# Altium schematic sheet wifi_car_mcu.SchDoc
size A3
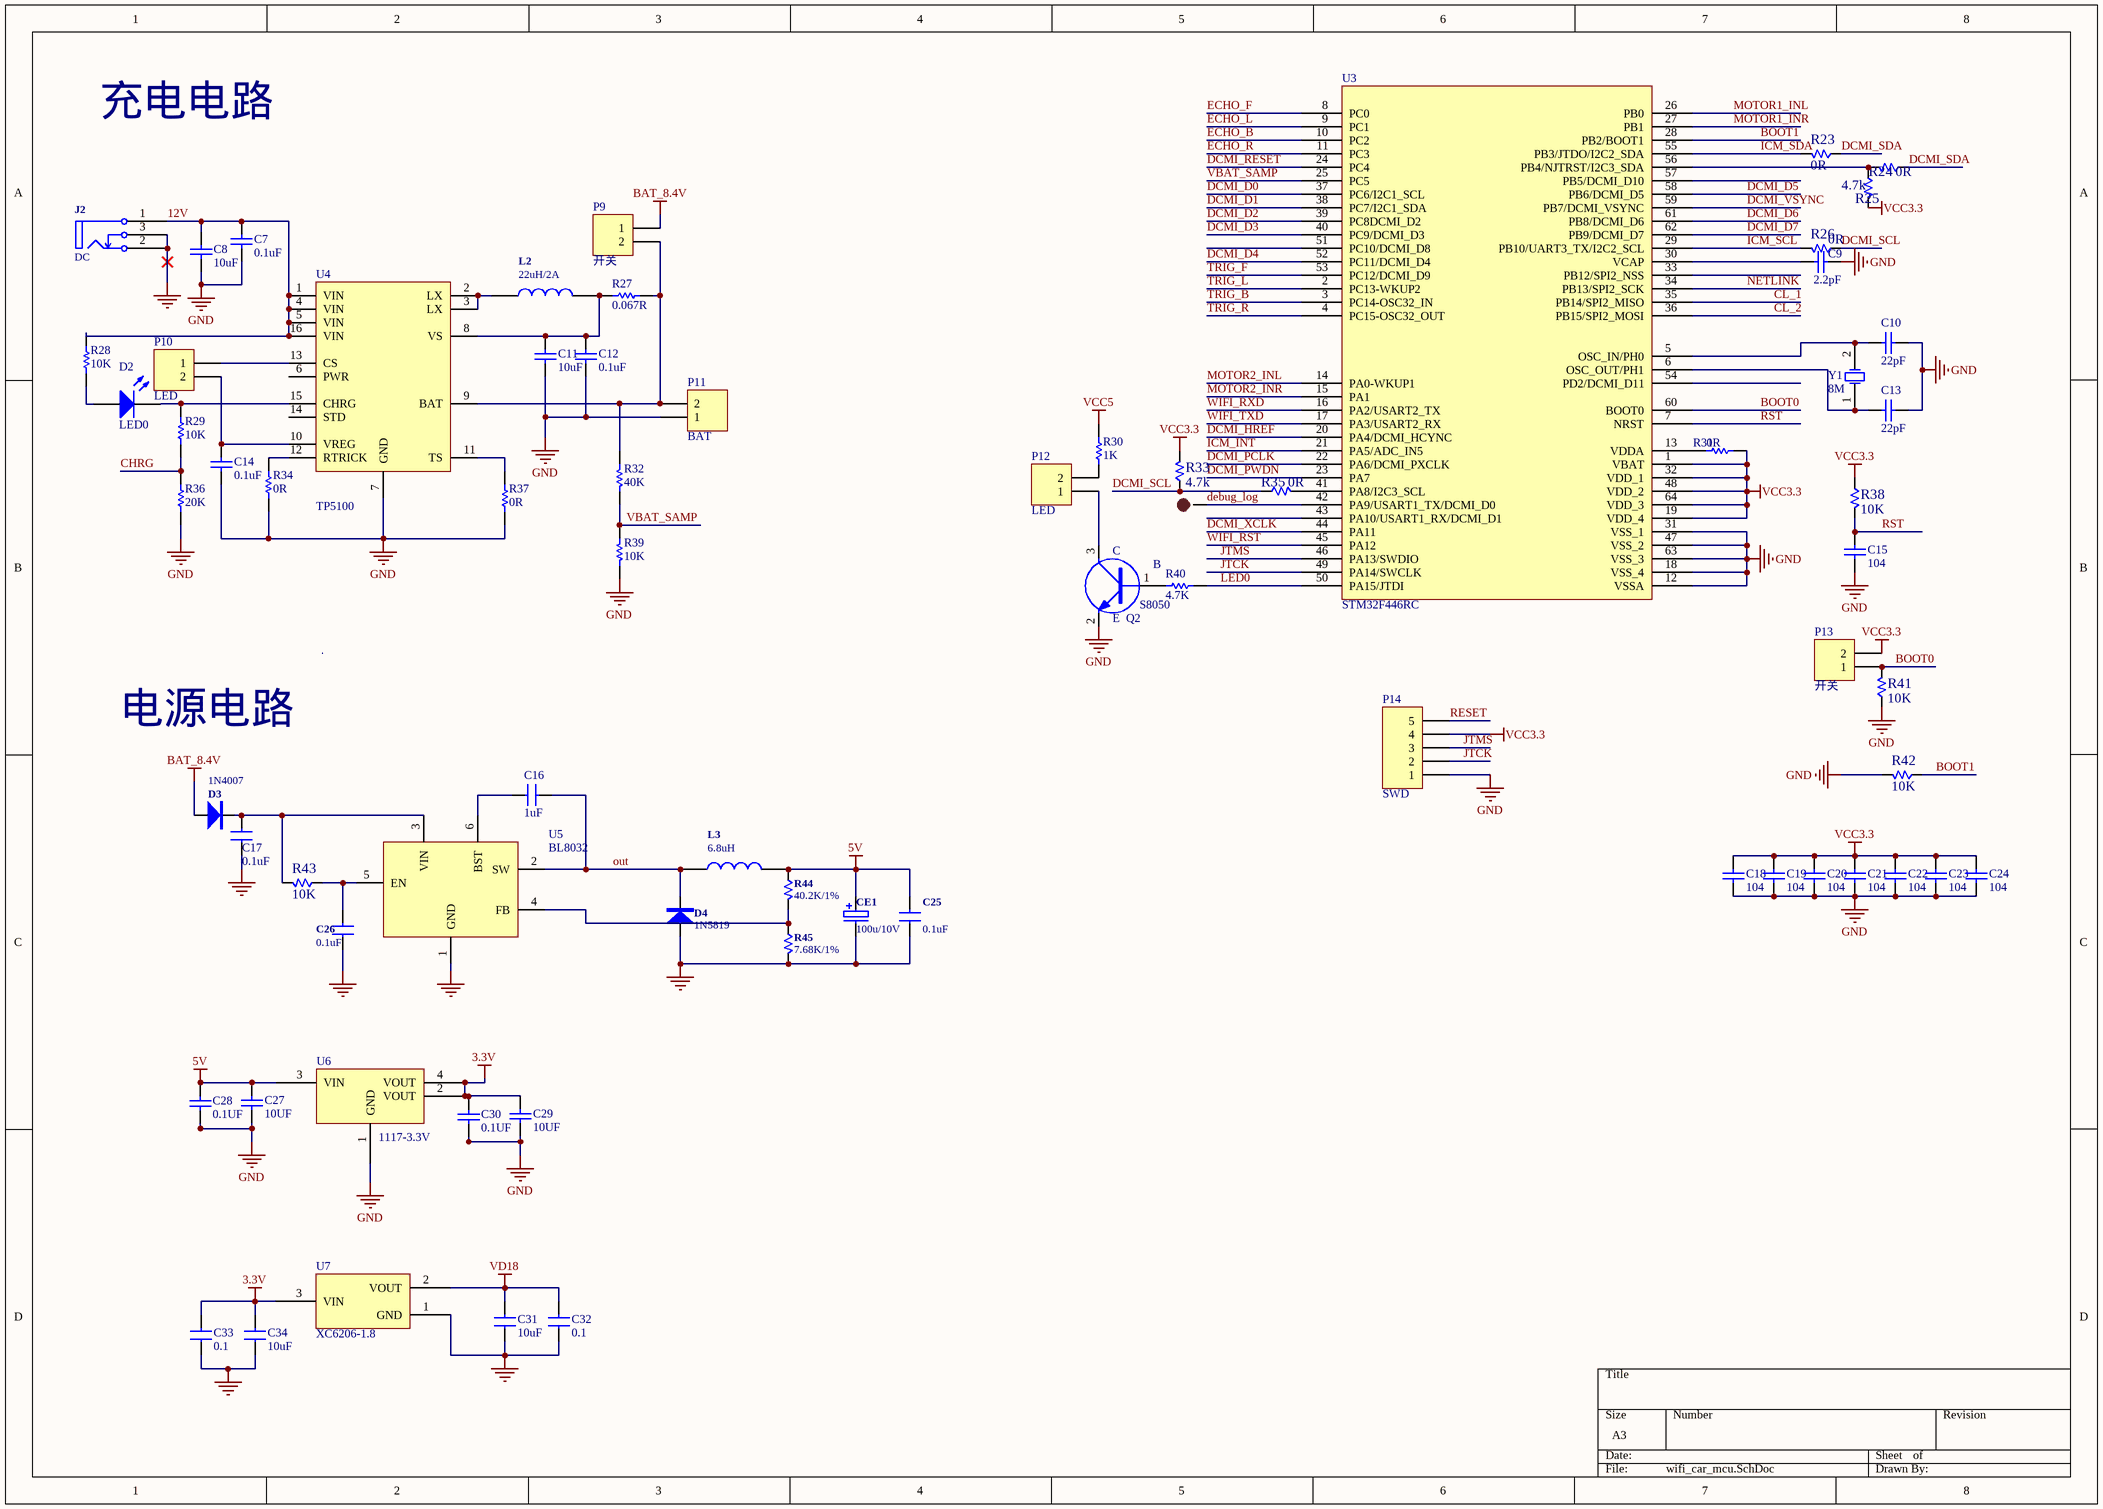
[diagram p0: wifi_car_mcu.SchDoc]

## Parts
C7  0.1uF  [0603C]
C8  10uF  [0805C]
C9  2.2pF  [0603C]
C10  22pF  [0603C]
C11  10uF  [0603C]
C12  0.1uF  [0603C]
C13  22pF  [0603C]
C14  0.1uF  [0603C]
C15  104  [0603C]
C16  1uF  [0603c]
C17  0.1uF  [C0603]
C18  104  [0603C]
C19  104  [0603C]
C20  104  [0603C]
C21  104  [0603C]
C22  104  [0603C]
C23  104  [0603C]
C24  104  [0603C]
C25  0.1uF  [C0603]
C26  0.1uF  [C0603]
C27  value 10UF  [0603C]  (hidden comment: Cap)
C28  value 0.1UF  [0603C]  (hidden comment: Cap)
C29  value 10UF  [0603C]  (hidden comment: Cap)
C30  value 0.1UF  [0603C]  (hidden comment: Cap)
C31  10uF  [C0603]
C32  0.1  [C0603]
C33  0.1  [C0603]
C34  10uF  [C0603]
CE1  100u/10V  [C_195]
D2  LED0  [0603LED]
D3  1N4007  [DO-214AC]
D4  1N5819  [DO-214AC]
J2  DC  [dc5V]
L2  22uH/2A  [WE_PD]
L3  6.8uH  [WE_PD]
P9  开关  [SIP2]
P10  LED  [SIP2]
P11  BAT  [CON2]
P12  LED  [CON2]
P13  开关  [SIP2]
P14  SWD  [HDR1X5]
Q2  S8050  [SOT-23]
R23  0R  [R0603]
R24  0R  [R0603]
R25  4.7k  [R0603]
R26  0R  [R0603]
R27  0.067R  [1206]
R28  10K  [0603C]
R29  10K  [0603C]
R30  1K  [0603R]
R31  0R  [0603R]
R32  40K  [0603R]
R33  4.7k  [R0603]
R34  0R  [0603C]
R35  0R  [R0603]
R36  20K  [0603C]
R37  0R  [0603R]
R38  10K  [R0603]
R39  10K  [0603R]
R40  4.7K  [0603R]
R41  10K  [R0603]
R42  10K  [R0603]
R43  10K  [R0603]
R44  40.2K/1%  [R0603]
R45  7.68K/1%  [R0603]
SP+?  SPK+  [TP-1.5]  (value not drawn)
U3  STM32F446RC  [LQFP64_10X10P]
U4  TP5100  [QFN16(4*4)]
U5  BL8032  [SOT23-6]
U6  1117-3.3V  [SOT223]
U7  XC6206-1.8  [SOT23C]
Y1  8M  [XTAL1]

## Nets
3.3V: C29.1 C30.1 C33.1 C34.1 U6.2(VOUT) U6.4(VOUT) U7.3(VIN)
5V: C25.1 C27.1 C28.1 CE1.1 L3.2 R44.1 U6.3(VIN)
BAT_8.4V: D3.1(A) P9.1
GND: C7.1 C8.2 C9.1 C10.1 C11.1 C12.1 C13.1 C14.1 C15.1 C17.2 C18.1 C19.1 C20.1 C21.1 C22.1 C23.1 C24.1 C25.2 C26.2 C27.2 C28.2 C29.2 C30.2 C31.2 C32.2 C33.2 C34.2 CE1.2 D4.1(A) J2.2 J2.3 P11.1 P14.1 Q2.2(E) R34.1 R36.1 R37.1 R39.2 R41.1 R42.2 R45.2 U3.12(VSSA) U3.18(VSS_4) U3.31(VSS_1) U3.47(VSS_2) U3.63(VSS_3) U4.7(GND) U5.1(GND) U6.1(GND) U7.1(GND)
VCC3.3: C18.2 C19.2 C20.2 C21.2 C22.2 C23.2 C24.2 P13.2 P14.4 R25.2 R31.2 R33.2 R38.1 U3.1(VBAT) U3.19(VDD_4) U3.32(VDD_1) U3.48(VDD_2) U3.64(VDD_3)
VCC5: R30.1
VD18: C31.1 C32.1 U7.2(VOUT)
12V: C7.2 C8.1 J2.1 R28.2 U4.1(VIN) U4.4(VIN) U4.5(VIN) U4.16(VIN)
BOOT0: P13.1 R41.2 U3.60(BOOT0)
BOOT1: R42.1 U3.28(PB2/BOOT1)
CHRG: R29.1 R36.2
CL_1: U3.35(PB14/SPI2_MISO)
CL_2: U3.36(PB15/SPI2_MOSI)
DCMI_D0: U3.37(PC6/I2C1_SCL)
DCMI_D1: U3.38(PC7/I2C1_SDA)
DCMI_D2: U3.39(PC8DCMI_D2)
DCMI_D3: U3.40(PC9/DCMI_D3)
DCMI_D4: U3.52(PC11/DCMI_D4)
DCMI_D5: U3.58(PB6/DCMI_D5)
DCMI_D6: U3.61(PB8/DCMI_D6)
DCMI_D7: U3.62(PB9/DCMI_D7)
DCMI_HREF: U3.20(PA4/DCMI_HCYNC)
DCMI_PCLK: U3.22(PA6/DCMI_PXCLK)
DCMI_PWDN: U3.23(PA7)
DCMI_RESET: U3.24(PC4)
DCMI_SCL: R26.1 R33.1 R35.1
DCMI_SDA: R23.1 R24.1
DCMI_VSYNC: U3.59(PB7/DCMI_VSYNC)
DCMI_XCLK: U3.44(PA11)
debug_log: SP+?.1 U3.42(PA9/USART1_TX/DCMI_D0)
ECHO_B: U3.10(PC2)
ECHO_F: U3.8(PC0)
ECHO_L: U3.9(PC1)
ECHO_R: U3.11(PC3)
ICM_INT: U3.21(PA5/ADC_IN5)
ICM_SCL: R26.2 U3.29(PB10/UART3_TX/I2C2_SCL)
ICM_SDA: R23.2 U3.55(PB3/JTDO/I2C2_SDA)
JTCK: P14.2 U3.49(PA14/SWCLK)
JTMS: P14.3 U3.46(PA13/SWDIO)
LED0: R40.1 U3.50(PA15/JTDI)
MOTOR1_INL: U3.26(PB0)
MOTOR1_INR: U3.27(PB1)
MOTOR2_INL: U3.14(PA0-WKUP1)
MOTOR2_INR: U3.15(PA1)
NETLINK: U3.34(PB13/SPI2_SCK)
out: C16.2 D4.2(K) L3.1 U5.2(SW)
RESET: P14.5
RST: C15.2 R38.2 U3.7(NRST)
TRIG_B: U3.3(PC14-OSC32_IN)
TRIG_F: U3.53(PC12/DCMI_D9)
TRIG_L: U3.2(PC13-WKUP2)
TRIG_R: U3.4(PC15-OSC32_OUT)
VBAT_SAMP: R32.2 R39.1 U3.25(PC5)
WIFI_RST: U3.45(PA12)
WIFI_RXD: U3.16(PA2/USART2_TX)
WIFI_TXD: U3.17(PA3/USART2_RX)
NetC9_2: C9.2 U3.30(VCAP)
NetC10_2: C10.2 U3.5(OSC_IN/PH0) Y1.2(OSC2)
NetC11_2: C11.2 C12.2 L2.2 R27.2 U4.8(VS)
NetC13_2: C13.2 U3.6(OSC_OUT/PH1) Y1.1(OSC1)
NetC14_2: C14.2 P10.2 U4.10(VREG)
NetC16_1: C16.1 U5.6(BST)
NetC17_1: C17.1 D3.2(K) R43.2 U5.3(VIN)
NetC26_1: C26.1 R43.1 U5.5(EN)
NetD2_1: D2.1(A) R28.1
NetD2_2: D2.2(K) R29.2 U4.15(CHRG)
NetL2_1: L2.1 U4.2(LX) U4.3(LX)
NetP9_2: P9.2 P11.2 R27.1 R32.1 U4.9(BAT)
NetP10_1: P10.1 U4.13(CS)
NetP12_1: P12.1 Q2.3(C)
NetP12_2: P12.2 R30.2
NetQ2_1: Q2.1(B) R40.2
NetR24_2: R24.2 R25.1 U3.56(PB4/NJTRST/I2C3_SDA)
NetR31_1: R31.1 U3.13(VDDA)
NetR34_2: R34.2 U4.12(RTRICK)
NetR35_2: R35.2 U3.41(PA8/I2C3_SCL)
NetR37_2: R37.2 U4.11(TS)
NetR44_2: R44.2 R45.1 U5.4(FB)

Not connected (* = marked no-connect by the designer): U3 33(PB12/SPI2_NSS) 43(PA10/USART1_RX/DCMI_D1) 51(PC10/DCMI_D8) 54(PD2/DCMI_D11) 57(PB5/DCMI_D10); U4 6(PWR) 14(STD)

## Notes on the sheet
- 充电电路
- 电源电路

## Library data of the parts
C7 C11 C12 C14 = CAP: Capacitor; Value: 100pF; Published: 8-Jun-2000; Revision: July-2002: Re-released for DXP Platform.; Publisher: Altium Limited
C8 = Cap: Capacitor; Value: 4.7uF; Published: 8-Jun-2000; LatestRevisionDate: 17-Jul-2002; LatestRevisionNote: Re-released for DXP Platform.; PackageReference: RAD-0.3; Publisher: Altium Limited
C9 C10 C13 C27-C30 = Cap: Capacitor; Published: 8-Jun-2000; LatestRevisionDate: 17-Jul-2002; LatestRevisionNote: Re-released for DXP Platform.; PackageReference: RAD-0.3; Publisher: Altium Limited
  C27-C30: PackageDescription: Radial Cap, Thru-Hole; 2 Leads; 0.3 in Pin Spacing
C15 C18-C24 = Cap_1: Capacitor; Published: 8-Jun-2000; LatestRevisionDate: 17-Jul-2002; LatestRevisionNote: Re-released for DXP Platform.; PackageReference: RAD-0.3; Publisher: Altium Limited
C16 C17 C25 C26 = CAP: Capacitor; IC: *
C31-C34 = C: Capacitor; IC: *
CE1 = CE
D2 = LED0: Typical INFRARED GaAs LED; Published: 8-Jun-2000; LatestRevisionDate: 08-Jul-2005; LatestRevisionNote: Mech Layer 1 removed.; PackageReference: LED-0; Publisher: Altium Limited; PackageDescription: LED; 2 Leads
D3 D4 = D: Diode
J2 = POWERCON
L2 L3 = INDUCTOR
P9-P12 = Header 2: Header, 2-Pin; LatestRevisionDate: 17-Jul-2002; LatestRevisionNote: Re-released for DXP Platform.; Publisher: Altium Limited
P13 = Header 2_1: Header, 2-Pin; LatestRevisionDate: 17-Jul-2002; LatestRevisionNote: Re-released for DXP Platform.; Publisher: Altium Limited
P14 = Header 5: Header, 5-Pin; LatestRevisionDate: 17-Jul-2002; LatestRevisionNote: Re-released for DXP Platform.; Publisher: Altium Limited
Q2 = NPN_1
R23-R26 R33 R35 R38 R41 R42 = R_1: Resistor
R27-R29 R34 R36 R37 = Res1: Resistor; Value: 1K; Published: 8-Jun-2000; LatestRevisionDate: 17-Jul-2002; LatestRevisionNote: Re-released for DXP Platform.; PackageReference: AXIAL-0.3; Publisher: Altium Limited
R30 = Res1_4: Resistor; Published: 8-Jun-2000; LatestRevisionDate: 17-Jul-2002; LatestRevisionNote: Re-released for DXP Platform.; PackageReference: AXIAL-0.3; Publisher: Altium Limited; Value: 1K
R31 R40 = Res1_4: Resistor; Value: 1K; Published: 8-Jun-2000; LatestRevisionDate: 17-Jul-2002; LatestRevisionNote: Re-released for DXP Platform.; PackageReference: AXIAL-0.3; Publisher: Altium Limited
R32 R39 = res1: Resistor; Value: 1K; Published: 8-Jun-2000; Revision: July-2002: Re-released for DXP Platform.; Publisher: Altium Limited
R43-R45 = R: Resistor
SP+? = TEST-POINT: 测试点
U4 = TP5100: Capacitor; Value: 4.7uF; Published: 8-Jun-2000; LatestRevisionDate: 17-Jul-2002; LatestRevisionNote: Re-released for DXP Platform.; PackageReference: RAD-0.3; Publisher: Altium Limited
U5 = BL8032: Diode Bridge
U6 = 1117: LDO; Published: 8-Jun-2000; LatestRevisionDate: 17-Jul-2002; LatestRevisionNote: Re-released for DXP Platform.; PackageReference: POLAR0.8; Publisher: Altium Limited
U7 = XC6206
Y1 = XTAL: Crystal Oscillator; Y?: 32.768kHz; Published: 8-Jun-2000; LatestRevisionDate: 17-Jul-2002; LatestRevisionNote: Re-released for DXP Platform.; PackageReference: R38; Publisher: Altium Limited